# Altium project WatchDogAlarm_rev1_3.PrjPcb
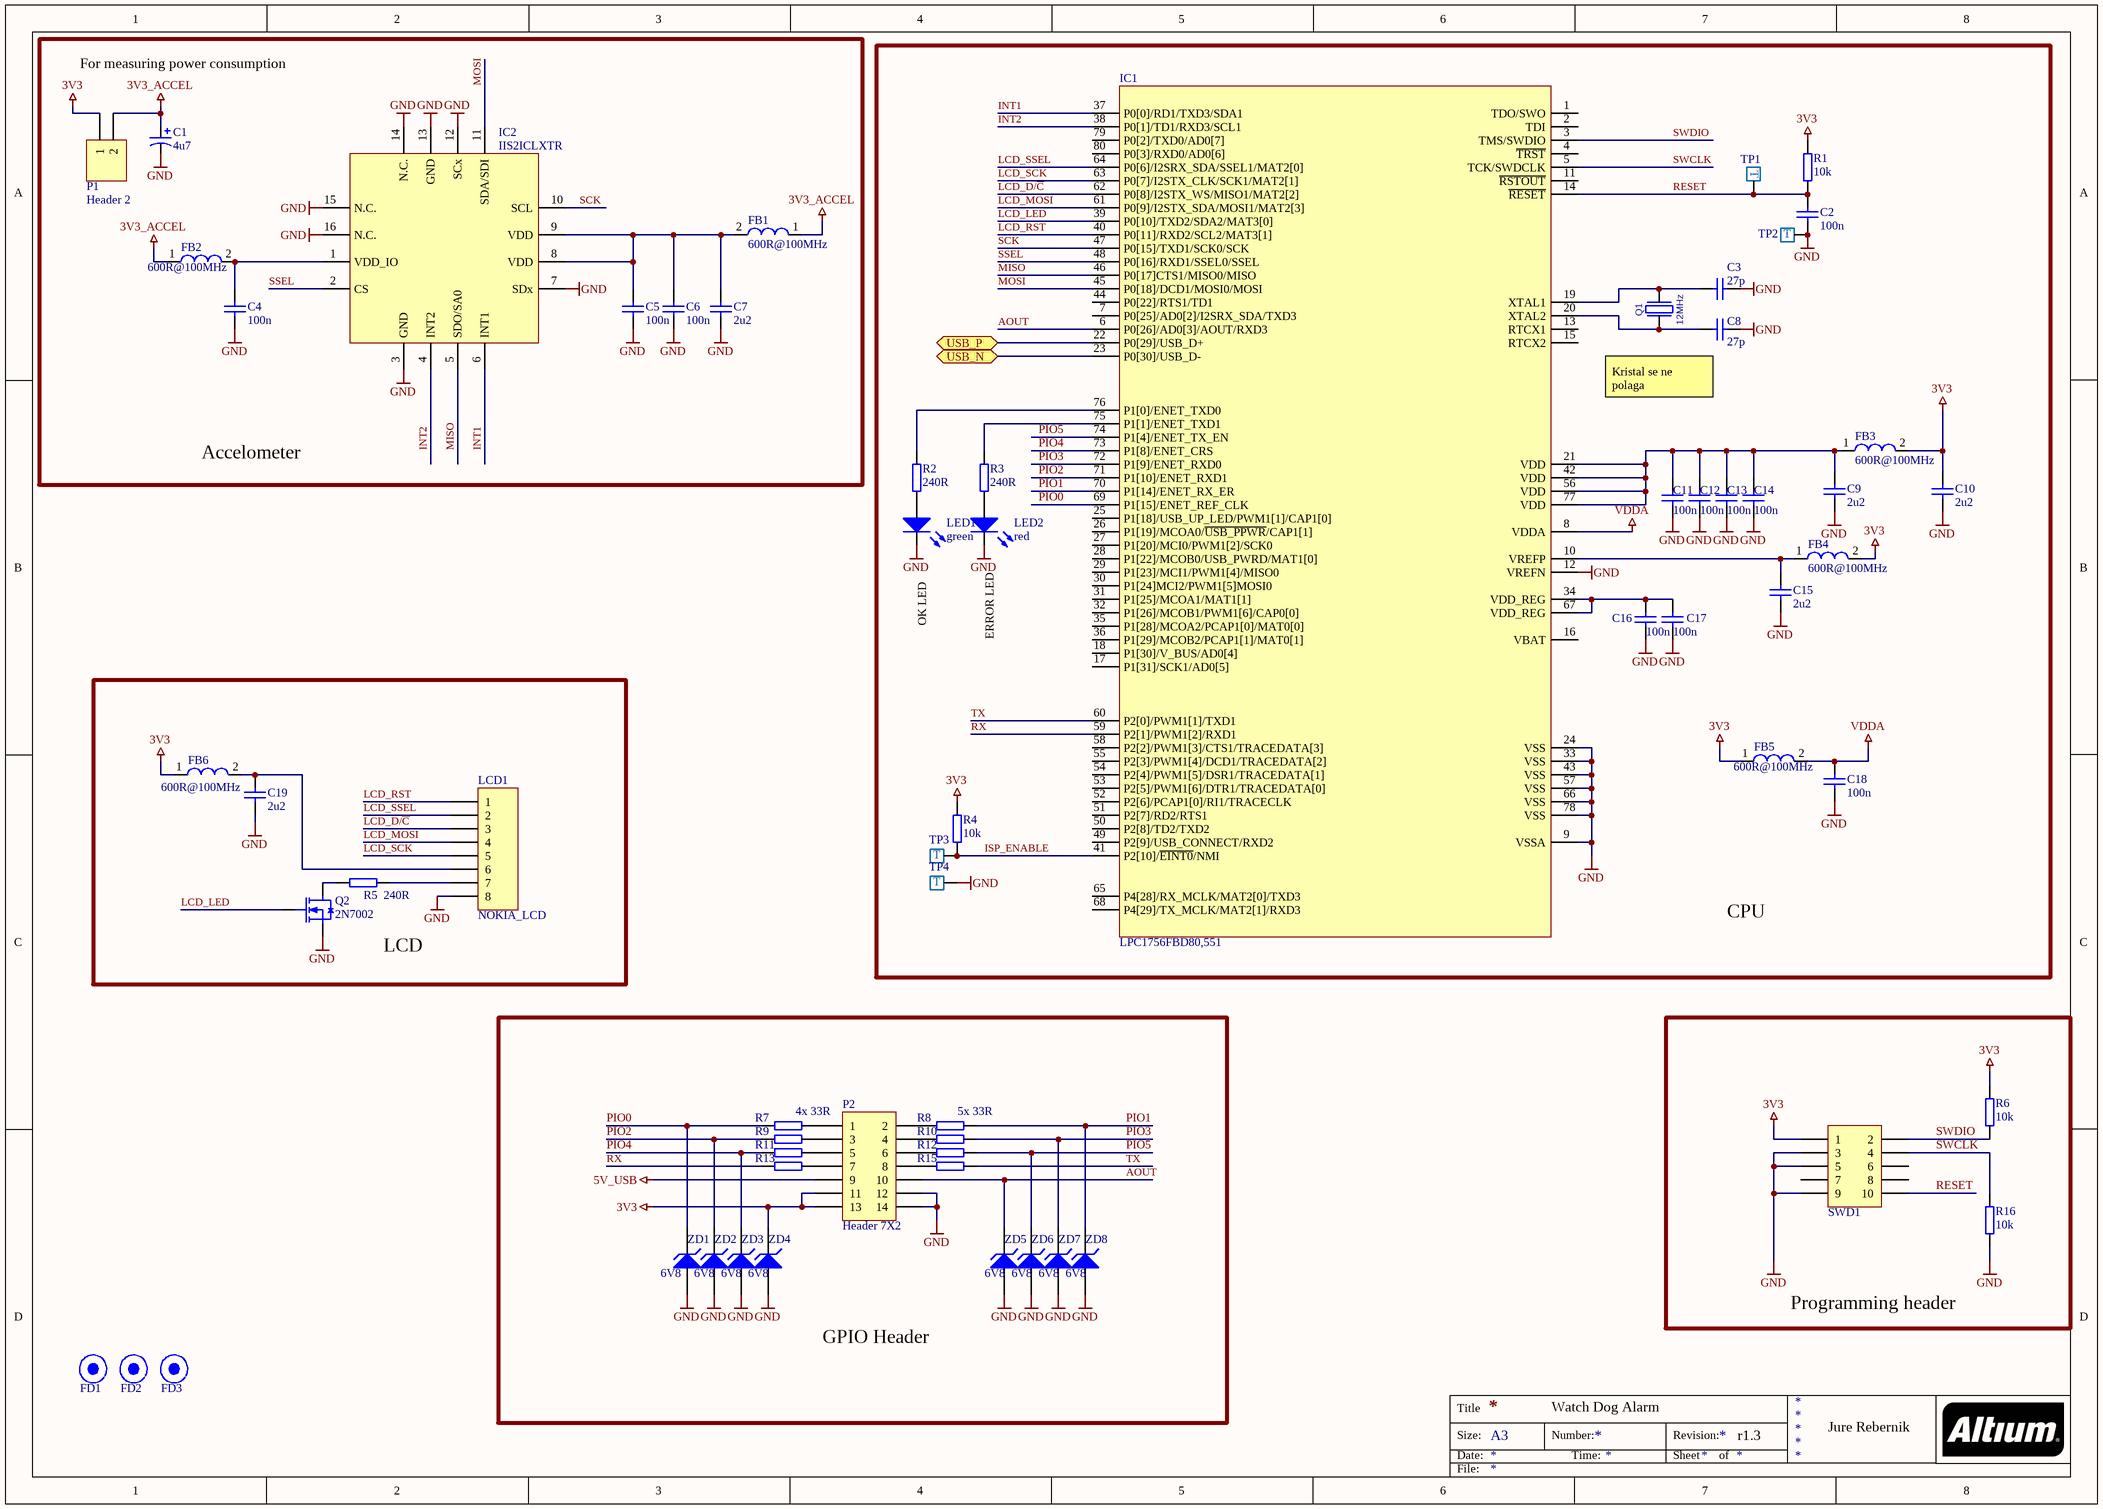
[diagram p0: WatchDogAlarm_rev1_3.SchDoc]
2 sheets, 90 parts. Net scope: flat (ports and power ports of the same name join across sheets).
Board file: WatchDogAlarm_rev1_3.PcbDoc
Sheets:
  WatchDogAlarm_rev1_3.SchDoc
  Power.SchDoc

## Sheet WatchDogAlarm_rev1_3.SchDoc
size A3

### Parts
C1  4u7  [Tantalum 3216]
C2  100n  [SMD_C0603]
C3  27p  [SMD_C0603]
C4  100n  [SMD_C0603]
C5  100n  [SMD_C0603]
C6  100n  [SMD_C0603]
C7  2u2  [SMD_C0805]
C8  27p  [SMD_C0603]
C9  2u2  [SMD_C0805]
C10  2u2  [SMD_C0805]
C11  100n  [SMD_C0603]
C12  100n  [SMD_C0603]
C13  100n  [SMD_C0603]
C14  100n  [SMD_C0603]
C15  2u2  [SMD_C0805]
C16  100n  [SMD_C0603]
C17  100n  [SMD_C0603]
C18  100n  [SMD_C0603]
C19  2u2  [SMD_C0805]
FB1  600R@100MHz  [SMD_R0603]
FB2  600R@100MHz  [SMD_R0603]
FB3  600R@100MHz  [SMD_R0603]
FB4  600R@100MHz  [SMD_R0603]
FB5  600R@100MHz  [SMD_R0603]
FB6  600R@100MHz  [SMD_R0603]
FD1  Fiducial 1mm  [FID1]  (value not drawn)  (no BOM)
FD2  Fiducial 1mm  [FID1]  (value not drawn)  (no BOM)
FD3  Fiducial 1mm  [FID1]  (value not drawn)  (no BOM)
IC1  LPC1756FBD80,551  [LQFP80]
IC2  IIS2ICLXTR  [LGA-16L]
LCD1  NOKIA_LCD  [NOKIA_LCD]
LED1  green  [SMD_LD0603]
LED2  red  [SMD_LD0603]
P1  Header 2  [HDR1X2]
P2  Header 7X2  [HDR2X7]
Q1  12MHz  [QABM3]
Q2  2N7002  [SOT-23]
R1  10k  [SMD_R0603]
R2  240R  [SMD_R0603]
R3  240R  [SMD_R0603]
R4  10k  [SMD_R0603]
R5  240R  [SMD_R0603]
R6  10k  [SMD_R0603]
R7  33R  [SMD_R0603]  (value not drawn)
R8  33R  [SMD_R0603]  (value not drawn)
R9  33R  [SMD_R0603]  (value not drawn)
R10  33R  [SMD_R0603]  (value not drawn)
R11  33R  [SMD_R0603]  (value not drawn)
R12  33R  [SMD_R0603]  (value not drawn)
R13  33R  [SMD_R0603]  (value not drawn)
R15  33R  [SMD_R0603]  (value not drawn)
R16  10k  [SMD_R0603]
SWD1  Header 5x2  [2x5_SWD_CON]  (value not drawn)
TP1  TEST_PAD_1.5mm  [TEST_PAD_1.5mm]  (value not drawn)
TP2  TEST_PAD_1.5mm  [TEST_PAD_1.5mm]  (value not drawn)
TP3  TEST_PAD_1.5mm  [TEST_PAD_1.5mm]  (value not drawn)
TP4  TEST_PAD_1.5mm  [TEST_PAD_1.5mm]  (value not drawn)
ZD1  6V8  [SOT-23]
ZD2  6V8  [SOT-23]
ZD3  6V8  [SOT-23]
ZD4  6V8  [SOT-23]
ZD5  6V8  [SOT-23]
ZD6  6V8  [SOT-23]
ZD7  6V8  [SOT-23]
ZD8  6V8  [SOT-23]

### Blocks framed on the sheet
Accelometer: C1 C4-C7 FB1 FB2 IC2 P1
CPU: C2 C3 C8-C18 FB3-FB5 IC1 LED1 LED2 Q1 R1-R4 TP1-TP4
LCD: C19 FB6 LCD1 Q2 R5
GPIO Header: P2 R7-R13 R15 ZD1-ZD8
Programming header: R6 R16 SWD1

### Ports
USB_N (bidir), USB_P (bidir)

### Nets
3V3: C10.2 FB3.2 FB4.2 FB5.1 FB6.1 P1.1 P2.11 P2.13 R1.2 R4.2 R6.2 SWD1.1 ZD4.3(K)
3V3_ACCEL: C1.1 FB1.1 FB2.1 P1.2
5V_USB: P2.9
GND: C1.2 C2.1 C3.1 C4.1 C5.1 C6.1 C7.1 C8.1 C9.1 C10.1 C11.1 C12.1 C13.1 C14.1 C15.1 C16.1 C17.1 C18.2 C19.1 IC1.9(VSSA) IC1.12(VREFN) IC1.24(VSS) IC1.33(VSS) IC1.43(VSS) IC1.57(VSS) IC1.66(VSS) IC1.78(VSS) IC2.3(GND) IC2.7(SDx) IC2.12(SCx) IC2.13(GND) IC2.14(N.C.) IC2.15(N.C.) IC2.16(N.C.) LCD1.8 LED1.1(K) LED2.1(K) P2.12 P2.14 Q2.2(S) R16.1 SWD1.3 SWD1.5 SWD1.9 TP2.1 TP4.1 ZD1.1(A) ZD2.1(A) ZD3.1(A) ZD4.1(A) ZD5.1(A) ZD6.1(A) ZD7.1(A) ZD8.1(A)
VDDA: C18.1 FB5.2 IC1.8(VDDA)
AOUT: IC1.6(P0[26]/AD0[3]/AOUT/RXD3) P2.10 ZD5.3(K)
INT1: IC1.37(P0[0]/RD1/TXD3/SDA1) IC2.6(INT1)
INT2: IC1.38(P0[1]/TD1/RXD3/SCL1) IC2.4(INT2)
ISP_ENABLE: IC1.41(P2[10]/~{EINT0}/NMI) R4.1 TP3.1
LCD_D/~{C}: IC1.62(P0[8]/I2STX_WS/MISO1/MAT2[2]) LCD1.3
LCD_LED: IC1.39(P0[10]/TXD2/SDA2/MAT3[0]) Q2.1(G)
LCD_MOSI: IC1.61(P0[9]/I2STX_SDA/MOSI1/MAT2[3]) LCD1.4
LCD_RST: IC1.40(P0[11]/RXD2/SCL2/MAT3[1]) LCD1.1
LCD_SCK: IC1.63(P0[7]/I2STX_CLK/SCK1/MAT2[1]) LCD1.5
LCD_SSEL: IC1.64(P0[6]/I2SRX_SDA/SSEL1/MAT2[0]) LCD1.2
MISO: IC1.46(P0[17]CTS1/MISO0/MISO) IC2.5(SDO/SA0)
MOSI: IC1.45(P0[18]/DCD1/MOSI0/MOSI) IC2.11(SDA/SDI)
PIO0: IC1.69(P1[15]/ENET_REF_CLK) R7.2 ZD1.3(K)
PIO1: IC1.70(P1[14]/ENET_RX_ER) R8.1 ZD8.3(K)
PIO2: IC1.71(P1[10]/ENET_RXD1) R9.2 ZD2.3(K)
PIO3: IC1.72(P1[9]/ENET_RXD0) R10.1 ZD7.3(K)
PIO4: IC1.73(P1[8]/ENET_CRS) R11.2 ZD3.3(K)
PIO5: IC1.74(P1[4]/ENET_TX_EN) R12.1 ZD6.3(K)
RESET: C2.2 IC1.14(~{RESET}) R1.1 SWD1.10 TP1.1
RX: IC1.59(P2[1]/PWM1[2]/RXD1) R13.2
SCK: IC1.47(P0[15]/TXD1/SCK0/SCK) IC2.10(SCL)
SSEL: IC1.48(P0[16]/RXD1/SSEL0/SSEL) IC2.2(CS)
SWCLK: IC1.5(TCK/SWDCLK) R16.2 SWD1.4
SWDIO: IC1.3(TMS/SWDIO) R6.1 SWD1.2
TX: IC1.60(P2[0]/PWM1[1]/TXD1) R15.1
USB_N: IC1.23(P0[30]/USB_D-) ; port USB_N
USB_P: IC1.22(P0[29]/USB_D+) ; port USB_P
NetC3_2: C3.2 IC1.19(XTAL1) Q1.1
NetC4_2: C4.2 FB2.2 IC2.1(VDD_IO)
NetC5_2: C5.2 C6.2 C7.2 FB1.2 IC2.8(VDD) IC2.9(VDD)
NetC8_2: C8.2 IC1.20(XTAL2) Q1.2
NetC9_2: C9.2 C11.2 C12.2 C13.2 C14.2 FB3.1 IC1.21(VDD) IC1.42(VDD) IC1.56(VDD) IC1.77(VDD)
NetC15_2: C15.2 FB4.1 IC1.10(VREFP)
NetC16_2: C16.2 C17.2 IC1.34(VDD_REG) IC1.67(VDD_REG)
NetC19_2: C19.2 FB6.2 LCD1.6
NetIC1_75: IC1.75(P1[1]/ENET_TXD1) R3.2
NetIC1_76: IC1.76(P1[0]/ENET_TXD0) R2.2
NetLCD1_7: LCD1.7 R5.1
NetLED1_2: LED1.2(A) R2.1
NetLED2_2: LED2.2(A) R3.1
NetP2_1: P2.1 R7.1
NetP2_2: P2.2 R8.2
NetP2_3: P2.3 R9.1
NetP2_4: P2.4 R10.2
NetP2_5: P2.5 R11.1
NetP2_6: P2.6 R12.2
NetP2_7: P2.7 R13.1
NetP2_8: P2.8 R15.2
NetQ2_3: Q2.3(D) R5.2

Not connected (* = marked no-connect by the designer): IC1 1(TDO/SWO) 2(TDI) 4(~{TRST}) 7(P0[25]/AD0[2]/I2SRX_SDA/TXD3) 11(~{RSTOUT}) 13(RTCX1) 15(RTCX2) 16(VBAT) 17(P1[31]/SCK1/AD0[5]) 18(P1[30]/V_BUS/AD0[4]) 25(P1[18]/USB_UP_LED/PWM1[1]/CAP1[0]) 26(P1[19]/MCOA0/~{USB_PPWR}/CAP1[1]) 27(P1[20]/MCI0/PWM1[2]/SCK0) 28(P1[22]/MCOB0/USB_PWRD/MAT1[0]) 29(P1[23]/MCI1/PWM1[4]/MISO0) 30(P1[24]MCI2/PWM1[5]MOSI0) 31(P1[25]/MCOA1/MAT1[1]) 32(P1[26]/MCOB1/PWM1[6]/CAP0[0]) 35(P1[28]/MCOA2/PCAP1[0]/MAT0[0]) 36(P1[29]/MCOB2/PCAP1[1]/MAT0[1]) 44(P0[22]/RTS1/TD1) 49(P2[9]/USB_CONNECT/RXD2) 50(P2[8]/TD2/TXD2) 51(P2[7]/RD2/RTS1) 52(P2[6]/PCAP1[0]/RI1/TRACECLK) 53(P2[5]/PWM1[6]/DTR1/TRACEDATA[0]) 54(P2[4]/PWM1[5]/DSR1/TRACEDATA[1]) 55(P2[3]/PWM1[4]/DCD1/TRACEDATA[2]) 58(P2[2]/PWM1[3]/CTS1/TRACEDATA[3]) 65(P4[28]/RX_MCLK/MAT2[0]/TXD3) 68(P4[29]/TX_MCLK/MAT2[1]/RXD3) 79(P0[2]/TXD0/AD0[7]) 80(P0[3]/RXD0/AD0[6]); SWD1 6 7 8

### Notes on the sheet
- For measuring power consumption
- Kristal se ne polaga
- OK LED
- (near LED2) ERROR LED
- 4x 33R
- (near R8) 5x 33R
- Watch Dog Alarm
- r1.3
- Jure Rebernik
- Title
- Size:
- Date:
- A3
- Number:
- Time:
- Revision:
- Sheet
- of
- File:
- (in symbol TEST_PAD) T

### Library data of the parts
C1 = Capacitor - polarized: Generic polarized capacitor; Value: 4u7
C2-C19 = CAP: Capacitor; properties: capacitor; farnellCode: *
  C2 C4-C6 C11-C14 C16-C18: value: 100n
  C3 C8: value: 27p
  C7 C9 C10 C15 C19: value: 2u2
FB1-FB6 = FB: Ferrite bead; value: 600R@100MHz
FD1-FD3 = FIDUCIAL: Category: Fiducials
IC1 = LPC1756FBD80: manufacturer: NXP; properties: Scalable Mainstream 32-bit Microcontroller (MCU) based on ARM Cortex-M3 Core; partnumber: LPC1756FBD80,551; value: LPC1756FBD80,551; farnellCode: *
IC2 = IIS2ICLXTR: manufacturer: STM; properties: Inclinometers High-accuracy, high-resolution, low-power, 2-axis digital inclinometer with embedded Machine Learning Core; value: IIS2ICLXTR; partnumber: IIS2ICLXTR
LED1 LED2 = LED
  LED1: value: green
  LED2: value: red
P1 = Header 2: Header, 2-Pin; LatestRevisionDate: 17-Jul-2002; LatestRevisionNote: Re-released for DXP Platform.; Publisher: Altium Limited
P2 = Header 7X2: Header, 7-Pin, Dual row; LatestRevisionDate: 17-Jul-2002; LatestRevisionNote: Re-released for DXP Platform.; Publisher: Altium Limited
Q1 = Crystal: partnumber: ABM3-12.000MHZ-D2Y-T; manufacturer: ABRACON; properties: Crystal, 12 MHz, SMD, 5mm x 3.2mm, 30 ppm, 18 pF, 20 ppm, ABM3 Series; Value: 12MHz
Q2 = N-MOSFET: Power MOSFET, N Channel, 60 V, 300 mA, 2.8 ohm, SOT-23, Surface Mount; Manufacturer: NXP; Dealer number: 1510761; Dealer: Farnell; Max voltage: 60V; Max current: 0.3A; RDS: 2.8Ω; Max power disipation: 830mW; Type: N-enhancment mode; Logic level: Yes; Category: MOSFETs; Price: 0.039; Manufacturer Number: 2N7002; Case: SOT23-3; Technology: SMT; HelpURL: https://www.farnell.com/datasheets/1499179.pdf; SKU: 5000000000001
R1-R13 R15 R16 = RESISTOR: properties: resistor; farnellCode: *
  R1 R4 R6 R16: value: 10k
  R2 R3 R5: value: 240R
  R7-R13 R15: value: 33R
SWD1 = Header 5X2: Header, 5-Pin, Dual row; Manufacturer: HARWIN; PartNumber: M50-3500542; Properties: Board-To-Board Connector, 1.27 mm, 10 Contacts, Header, Archer M50 Series, Through Hole, 2 Rows; FarnellCode: 1022305; Value: Header 5x2
TP1-TP4 = TEST_PAD: value: TEST_PAD_1.5mm
ZD1-ZD8 = ZenerDiode: Zener Diode; Manufacturer: ON Semiconductor; PartNumber: BZX84C6V8LT1G; Properties: Zener Single Diode, 6.8 V, 225 mW, SOT-23, 6 %, 3 Pins, 150 °C; FarnellCode: 1651587; Value: 6V8

## Sheet Power.SchDoc
size A4
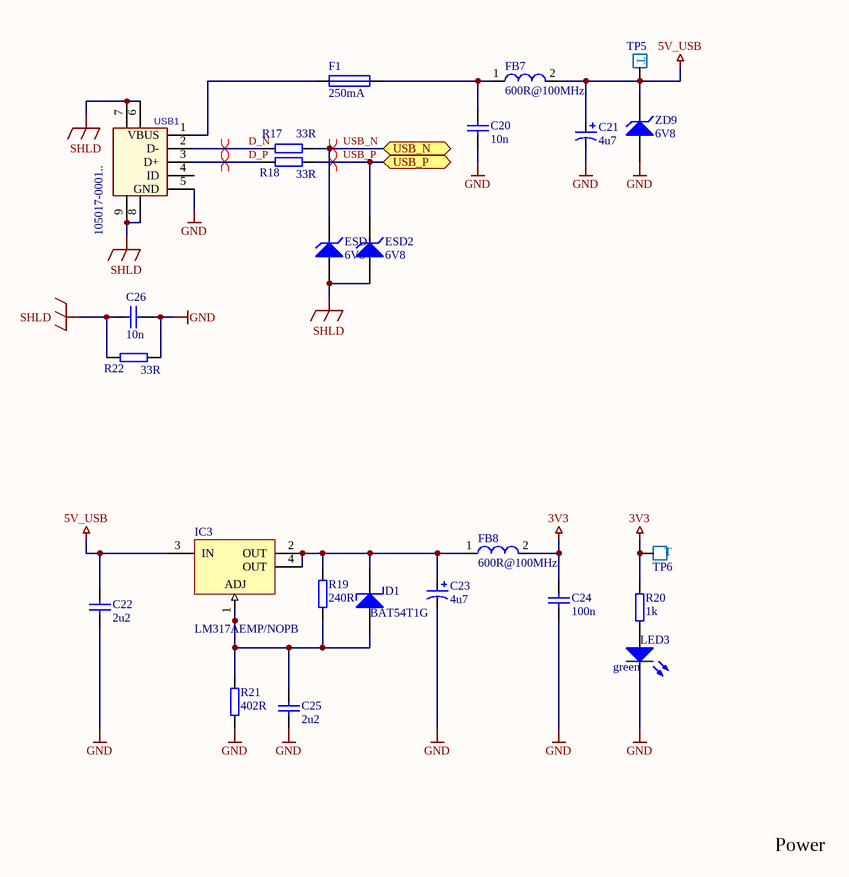
[diagram p1: Power.SchDoc]

### Parts
C20  10n  [SMD_C0603]
C21  4u7  [Tantalum 3216]
C22  2u2  [SMD_C0805]
C23  4u7  [Tantalum 3216]
C24  100n  [SMD_C0603]
C25  2u2  [SMD_C0805]
C26  10n  [SMD_C0603]
D1  BAT54T1G  [SOD-123]
ESD1  6V8  [SMD_R0603]
ESD2  6V8  [SMD_R0603]
F1  250mA  [PPTCF 1206]
FB7  600R@100MHz  [SMD_R0603]
FB8  600R@100MHz  [SMD_R0603]
IC3  LM317AEMP/NOPB  [SOT-223]
LED3  green  [SMD_LD0603]
R17  33R  [SMD_R0603]
R18  33R  [SMD_R0603]
R19  240R  [SMD_R0603]
R20  1k  [SMD_R0603]
R21  402R  [SMD_R0603]
R22  33R  [SMD_R0603]
TP5  TEST_PAD_1.5mm  [TEST_PAD_1.5mm]  (value not drawn)
TP6  TEST_PAD_1.5mm  [TEST_PAD_1.5mm]  (value not drawn)
USB1  105017-0001..  [USB_MICRO_B]
ZD9  6V8  [SOT-23]

### Ports
USB_N (bidir), USB_P (bidir)

### Nets
3V3: C24.2 FB8.2 R20.2 TP6.1
5V_USB: C21.1 C22.2 FB7.2 IC3.3(IN) TP5.1 ZD9.3(K)
GND: C20.1 C21.2 C22.1 C23.2 C24.1 C25.1 C26.1 LED3.1(K) R21.1 R22.1 USB1.5(GND) ZD9.1(A)
SHLD: C26.2 ESD1.1(A) ESD2.1(A) R22.2 USB1.6(GND1) USB1.7(GND2) USB1.8(GND2) USB1.9(GND3)
D_N: R17.2 USB1.2(D-)
D_P: R18.2 USB1.3(D+)
USB_N: ESD1.3(K) R17.1 ; port USB_N
USB_P: ESD2.3(K) R18.1 ; port USB_P
NetC20_2: C20.2 F1.2 FB7.1
NetC23_1: C23.1 D1.1(K) FB8.1 IC3.2(OUT) IC3.4(OUT) R19.2
NetC25_2: C25.2 D1.2(A) IC3.1(ADJ) R19.1 R21.2
NetF1_1: F1.1 USB1.1(VBUS)
NetLED3_2: LED3.2(A) R20.1

Not connected (* = marked no-connect by the designer): USB1 4(ID)

### Layout directives
differential pair: D_N, D_P, USB_N, USB_P

### Notes on the sheet
- Power
- (in symbol TEST_PAD) T

### Library data of the parts
C20 C22 C24-C26 = CAP: Capacitor; properties: capacitor; farnellCode: *
  C20 C26: value: 10n
  C22 C25: value: 2u2
  C24: value: 100n
C21 C23 = Capacitor - polarized: Generic polarized capacitor; Value: 4u7
D1 = DIODE_SCHOTTKY: manufacturer: ON SEMICONDUCTOR; properties: Small Signal Schottky Diode, Single, 30 V, 200 mA, 350 mV, 600 mA, 150 °C; value: BAT54T1G; partnumber: BAT54T1G; farnellCode: 1651157
ESD1 ESD2 = ZenerDiode: ESD Protection device; pin to pad: 3>2; Manufacturer: ON Semiconductor; PartNumber: BZX84C6V8LT1G; Properties: Zener Single Diode, 6.8 V, 225 mW, SOT-23, 6 %, 3 Pins, 150 °C; FarnellCode: 1651587; Value: 6V8
F1 = PolyFuse: Resettable Fuse, PPTC, 1206 (3216 Metric), POLYFUSE 1206L Series, 16 VDC, 250 mA, 500 mA, 0.08 s; Manufacturer: Littelfuse; Manufacturer Number: 2920L030DR; Dealer number: 1596990; Dealer: Farnell; Trip current: 500mA; Max voltage: 16V; Resistance: 2.3Ω; Category: Fuses; Price: 0.46; Type: Poly fuse; Holing current: 250mA; Technology: SMT; HelpURL: https://www.farnell.com/datasheets/683946.pdf
FB7 FB8 = FB: Ferrite bead; value: 600R@100MHz
IC3 = LM317KC: 3-Terminal Adjustable Regulator; manufacturer: TEXAS INSTRUMENTS; properties: Linear Voltage Regulator, Adjustable Positive, 40V primary input, 1.2V to 37V/1A/1 Output, SOT-223-4; value: LM317AEMP/NOPB; partnumber: LM317AEMP/NOPB; farnellCode: 3122676
LED3 = LED: value: green
R17-R22 = RESISTOR: properties: resistor; farnellCode: *
  R17 R18 R22: value: 33R
  R19: value: 240R
  R20: value: 1k
  R21: value: 402R
TP5 TP6 = TEST_PAD: value: TEST_PAD_1.5mm
USB1 = Micro_USB_MIUSB-F5M-BB-U: manufacturer: MOLEX; properties: USB Connector, Micro USB Type B, USB 2.0, Receptacle, 5 Ways, Surface Mount, Right Angle; value: 105017-0001..; partnumber: 105017-0001..; farnellCode: 2293836
ZD9 = ZenerDiode: as ZD1 on sheet WatchDogAlarm_rev1_3; FarnellCode: 1651587; Value: 6V8

## Nets that join several sheets
3V3: WatchDogAlarm_rev1_3 (13 pins), Power (C24.2 FB8.2 R20.2 TP6.1)
5V_USB: WatchDogAlarm_rev1_3 (P2.9), Power (6 pins)
GND: WatchDogAlarm_rev1_3 (54 pins), Power (12 pins)
USB_N: WatchDogAlarm_rev1_3 (IC1.23), Power (ESD1.3 R17.1)
USB_P: WatchDogAlarm_rev1_3 (IC1.22), Power (ESD2.3 R18.1)